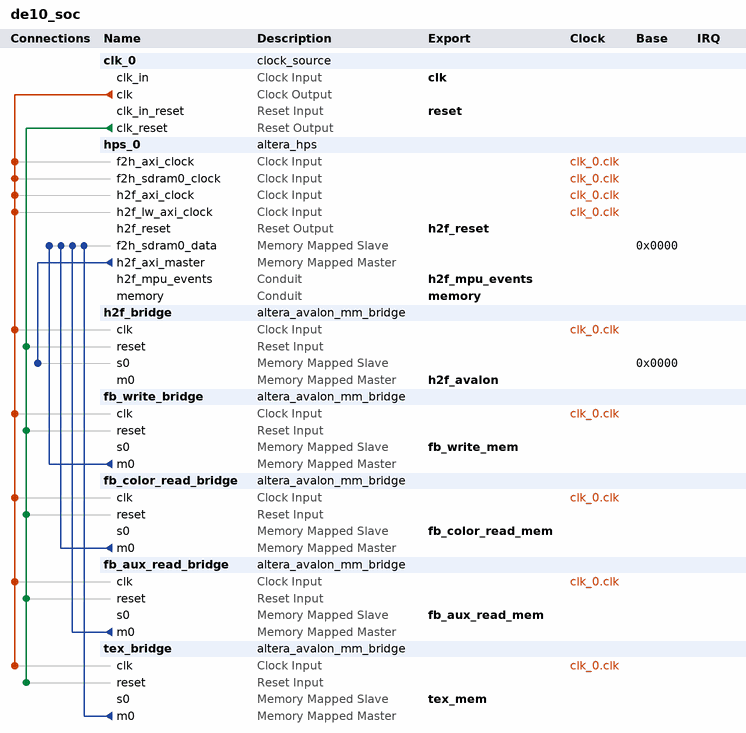
[diagram p0: system contents]
# Platform Designer (Qsys) system de10_soc, Cyclone V 5CSEBA6U23I7
# Parameters at their usual value, and those the tool derives, are not listed.
package require -exact qsys 24.1
create_system de10_soc
set_project_property DEVICE_FAMILY {Cyclone V}
set_project_property DEVICE 5CSEBA6U23I7

add_instance clk_0 clock_source 24.1
set_instance_parameter_value clk_0 clockFrequency 40000000

add_instance hps_0 altera_hps 24.1
set_instance_parameter_value hps_0 EMAC1_Mode N/A
set_instance_parameter_value hps_0 EMAC1_PinMuxing Unused
set_instance_parameter_value hps_0 F2SCLK_COLDRST_Enable false
set_instance_parameter_value hps_0 F2SCLK_DBGRST_Enable false
set_instance_parameter_value hps_0 F2SCLK_WARMRST_Enable false
set_instance_parameter_value hps_0 F2SDRAM_Type {Avalon-MM Bidirectional}
set_instance_parameter_value hps_0 F2SDRAM_Width 256
set_instance_parameter_value hps_0 F2SINTERRUPT_Enable false
set_instance_parameter_value hps_0 F2S_Width 3
set_instance_parameter_value hps_0 FPGA_PERIPHERAL_OUTPUT_CLOCK_FREQ_EMAC0_GTX_CLK 125
set_instance_parameter_value hps_0 FPGA_PERIPHERAL_OUTPUT_CLOCK_FREQ_EMAC0_MD_CLK 2.5
set_instance_parameter_value hps_0 FPGA_PERIPHERAL_OUTPUT_CLOCK_FREQ_EMAC1_GTX_CLK 125
set_instance_parameter_value hps_0 FPGA_PERIPHERAL_OUTPUT_CLOCK_FREQ_EMAC1_MD_CLK 2.5
set_instance_parameter_value hps_0 HPS_PROTOCOL DDR3
set_instance_parameter_value hps_0 I2C0_Mode N/A
set_instance_parameter_value hps_0 I2C0_PinMuxing Unused
set_instance_parameter_value hps_0 I2C1_Mode N/A
set_instance_parameter_value hps_0 I2C1_PinMuxing Unused
set_instance_parameter_value hps_0 LWH2F_Enable true
set_instance_parameter_value hps_0 MEM_BANKADDR_WIDTH 3
set_instance_parameter_value hps_0 MEM_CLK_FREQ 400.0
set_instance_parameter_value hps_0 MEM_COL_ADDR_WIDTH 10
set_instance_parameter_value hps_0 MEM_DQ_WIDTH 32
set_instance_parameter_value hps_0 MEM_DRV_STR RZQ/6
set_instance_parameter_value hps_0 MEM_ROW_ADDR_WIDTH 15
set_instance_parameter_value hps_0 MEM_RTT_NOM RZQ/6
set_instance_parameter_value hps_0 MEM_RTT_WR {Dynamic ODT off}
set_instance_parameter_value hps_0 MEM_TCL 7
set_instance_parameter_value hps_0 MEM_TFAW_NS 37.5
set_instance_parameter_value hps_0 MEM_TRAS_NS 35.0
set_instance_parameter_value hps_0 MEM_TRCD_NS 13.75
set_instance_parameter_value hps_0 MEM_TRFC_NS 300.0
set_instance_parameter_value hps_0 MEM_TRP_NS 13.75
set_instance_parameter_value hps_0 MEM_VENDOR JEDEC
set_instance_parameter_value hps_0 MEM_WTCL 6
set_instance_parameter_value hps_0 MPU_EVENTS_Enable true
set_instance_parameter_value hps_0 QSPI_Mode N/A
set_instance_parameter_value hps_0 QSPI_PinMuxing Unused
set_instance_parameter_value hps_0 REF_CLK_FREQ 125.0
set_instance_parameter_value hps_0 S2FCLK_USER2CLK 5
set_instance_parameter_value hps_0 S2F_Width 2
set_instance_parameter_value hps_0 SDIO_Mode N/A
set_instance_parameter_value hps_0 SDIO_PinMuxing Unused
set_instance_parameter_value hps_0 SPIM1_Mode N/A
set_instance_parameter_value hps_0 SPIM1_PinMuxing Unused
set_instance_parameter_value hps_0 STM_Enable false
set_instance_parameter_value hps_0 TIMING_BOARD_AC_SKEW 0.02
set_instance_parameter_value hps_0 TIMING_BOARD_AC_TO_CK_SKEW 0.0
set_instance_parameter_value hps_0 TIMING_BOARD_DQ_TO_DQS_SKEW 0.0
set_instance_parameter_value hps_0 TIMING_BOARD_MAX_CK_DELAY 0.6
set_instance_parameter_value hps_0 TIMING_BOARD_MAX_DQS_DELAY 0.6
set_instance_parameter_value hps_0 TIMING_BOARD_SKEW_BETWEEN_DQS 0.02
set_instance_parameter_value hps_0 TIMING_BOARD_SKEW_CKDQS_DIMM_MAX 0.01
set_instance_parameter_value hps_0 TIMING_BOARD_SKEW_CKDQS_DIMM_MIN -0.01
set_instance_parameter_value hps_0 TIMING_BOARD_SKEW_WITHIN_DQS 0.02
set_instance_parameter_value hps_0 TIMING_TDH 125
set_instance_parameter_value hps_0 TIMING_TDQSCK 400
set_instance_parameter_value hps_0 TIMING_TDQSQ 120
set_instance_parameter_value hps_0 TIMING_TDS 50
set_instance_parameter_value hps_0 TIMING_TIH 250
set_instance_parameter_value hps_0 TIMING_TIS 175
set_instance_parameter_value hps_0 TIMING_TQSH 0.38
set_instance_parameter_value hps_0 UART0_Mode N/A
set_instance_parameter_value hps_0 UART0_PinMuxing Unused
set_instance_parameter_value hps_0 USB1_Mode N/A
set_instance_parameter_value hps_0 USB1_PinMuxing Unused
set_instance_parameter_value hps_0 desired_cfg_clk_mhz 100.0
set_instance_parameter_value hps_0 desired_qspi_clk_mhz 400.0

add_instance h2f_bridge altera_avalon_mm_bridge 24.1
set_instance_parameter_value h2f_bridge ADDRESS_UNITS SYMBOLS
set_instance_parameter_value h2f_bridge ADDRESS_WIDTH 24
set_instance_parameter_value h2f_bridge DATA_WIDTH 32
set_instance_parameter_value h2f_bridge MAX_PENDING_RESPONSES 4
set_instance_parameter_value h2f_bridge USE_AUTO_ADDRESS_WIDTH 0

add_instance fb_write_bridge altera_avalon_mm_bridge 24.1
set_instance_parameter_value fb_write_bridge ADDRESS_UNITS SYMBOLS
set_instance_parameter_value fb_write_bridge ADDRESS_WIDTH 32
set_instance_parameter_value fb_write_bridge DATA_WIDTH 32
set_instance_parameter_value fb_write_bridge MAX_BURST_SIZE 1024
set_instance_parameter_value fb_write_bridge MAX_PENDING_RESPONSES 4
set_instance_parameter_value fb_write_bridge USE_AUTO_ADDRESS_WIDTH 0

add_instance fb_color_read_bridge altera_avalon_mm_bridge 24.1
set_instance_parameter_value fb_color_read_bridge ADDRESS_UNITS SYMBOLS
set_instance_parameter_value fb_color_read_bridge ADDRESS_WIDTH 32
set_instance_parameter_value fb_color_read_bridge DATA_WIDTH 32
set_instance_parameter_value fb_color_read_bridge MAX_BURST_SIZE 1024
set_instance_parameter_value fb_color_read_bridge MAX_PENDING_RESPONSES 4
set_instance_parameter_value fb_color_read_bridge USE_AUTO_ADDRESS_WIDTH 0

add_instance fb_aux_read_bridge altera_avalon_mm_bridge 24.1
set_instance_parameter_value fb_aux_read_bridge ADDRESS_UNITS SYMBOLS
set_instance_parameter_value fb_aux_read_bridge ADDRESS_WIDTH 32
set_instance_parameter_value fb_aux_read_bridge DATA_WIDTH 32
set_instance_parameter_value fb_aux_read_bridge MAX_BURST_SIZE 1024
set_instance_parameter_value fb_aux_read_bridge MAX_PENDING_RESPONSES 4
set_instance_parameter_value fb_aux_read_bridge USE_AUTO_ADDRESS_WIDTH 0

add_instance tex_bridge altera_avalon_mm_bridge 24.1
set_instance_parameter_value tex_bridge ADDRESS_UNITS SYMBOLS
set_instance_parameter_value tex_bridge ADDRESS_WIDTH 32
set_instance_parameter_value tex_bridge DATA_WIDTH 32
set_instance_parameter_value tex_bridge MAX_BURST_SIZE 1024
set_instance_parameter_value tex_bridge MAX_PENDING_RESPONSES 4
set_instance_parameter_value tex_bridge USE_AUTO_ADDRESS_WIDTH 0

# connections
add_connection clk_0.clk fb_aux_read_bridge.clk clock
add_connection clk_0.clk fb_color_read_bridge.clk clock
add_connection clk_0.clk fb_write_bridge.clk clock
add_connection clk_0.clk h2f_bridge.clk clock
add_connection clk_0.clk hps_0.f2h_axi_clock clock
add_connection clk_0.clk hps_0.f2h_sdram0_clock clock
add_connection clk_0.clk hps_0.h2f_axi_clock clock
add_connection clk_0.clk hps_0.h2f_lw_axi_clock clock
add_connection clk_0.clk tex_bridge.clk clock
add_connection clk_0.clk_reset fb_aux_read_bridge.reset reset
add_connection clk_0.clk_reset fb_color_read_bridge.reset reset
add_connection clk_0.clk_reset fb_write_bridge.reset reset
add_connection clk_0.clk_reset h2f_bridge.reset reset
add_connection clk_0.clk_reset tex_bridge.reset reset
add_connection fb_aux_read_bridge.m0 hps_0.f2h_sdram0_data avalon
set_connection_parameter_value fb_aux_read_bridge.m0/hps_0.f2h_sdram0_data baseAddress 0x0000
add_connection fb_color_read_bridge.m0 hps_0.f2h_sdram0_data avalon
set_connection_parameter_value fb_color_read_bridge.m0/hps_0.f2h_sdram0_data baseAddress 0x0000
add_connection fb_write_bridge.m0 hps_0.f2h_sdram0_data avalon
set_connection_parameter_value fb_write_bridge.m0/hps_0.f2h_sdram0_data baseAddress 0x0000
add_connection hps_0.h2f_axi_master h2f_bridge.s0 avalon
set_connection_parameter_value hps_0.h2f_axi_master/h2f_bridge.s0 baseAddress 0x0000
add_connection tex_bridge.m0 hps_0.f2h_sdram0_data avalon
set_connection_parameter_value tex_bridge.m0/hps_0.f2h_sdram0_data baseAddress 0x0000

# exported interfaces
add_interface clk clock sink
set_interface_property clk EXPORT_OF clk_0.clk_in
add_interface fb_aux_read_mem avalon slave
set_interface_property fb_aux_read_mem EXPORT_OF fb_aux_read_bridge.s0
add_interface fb_color_read_mem avalon slave
set_interface_property fb_color_read_mem EXPORT_OF fb_color_read_bridge.s0
add_interface fb_write_mem avalon slave
set_interface_property fb_write_mem EXPORT_OF fb_write_bridge.s0
add_interface h2f_avalon avalon master
set_interface_property h2f_avalon EXPORT_OF h2f_bridge.m0
add_interface h2f_mpu_events conduit end
set_interface_property h2f_mpu_events EXPORT_OF hps_0.h2f_mpu_events
add_interface h2f_reset reset source
set_interface_property h2f_reset EXPORT_OF hps_0.h2f_reset
add_interface memory conduit end
set_interface_property memory EXPORT_OF hps_0.memory
add_interface reset reset sink
set_interface_property reset EXPORT_OF clk_0.clk_in_reset
add_interface tex_mem avalon slave
set_interface_property tex_mem EXPORT_OF tex_bridge.s0

set_interconnect_requirement {$system} qsys_mm.clockCrossingAdapter HANDSHAKE
set_interconnect_requirement {$system} qsys_mm.enableEccProtection FALSE
set_interconnect_requirement {$system} qsys_mm.insertDefaultSlave FALSE
set_interconnect_requirement {$system} qsys_mm.maxAdditionalLatency 1

save_system de10_soc.qsys
